# EAGLE schematic microDriver_v2 (EAGLE 8.3.1)

## Sheet 1 of 3
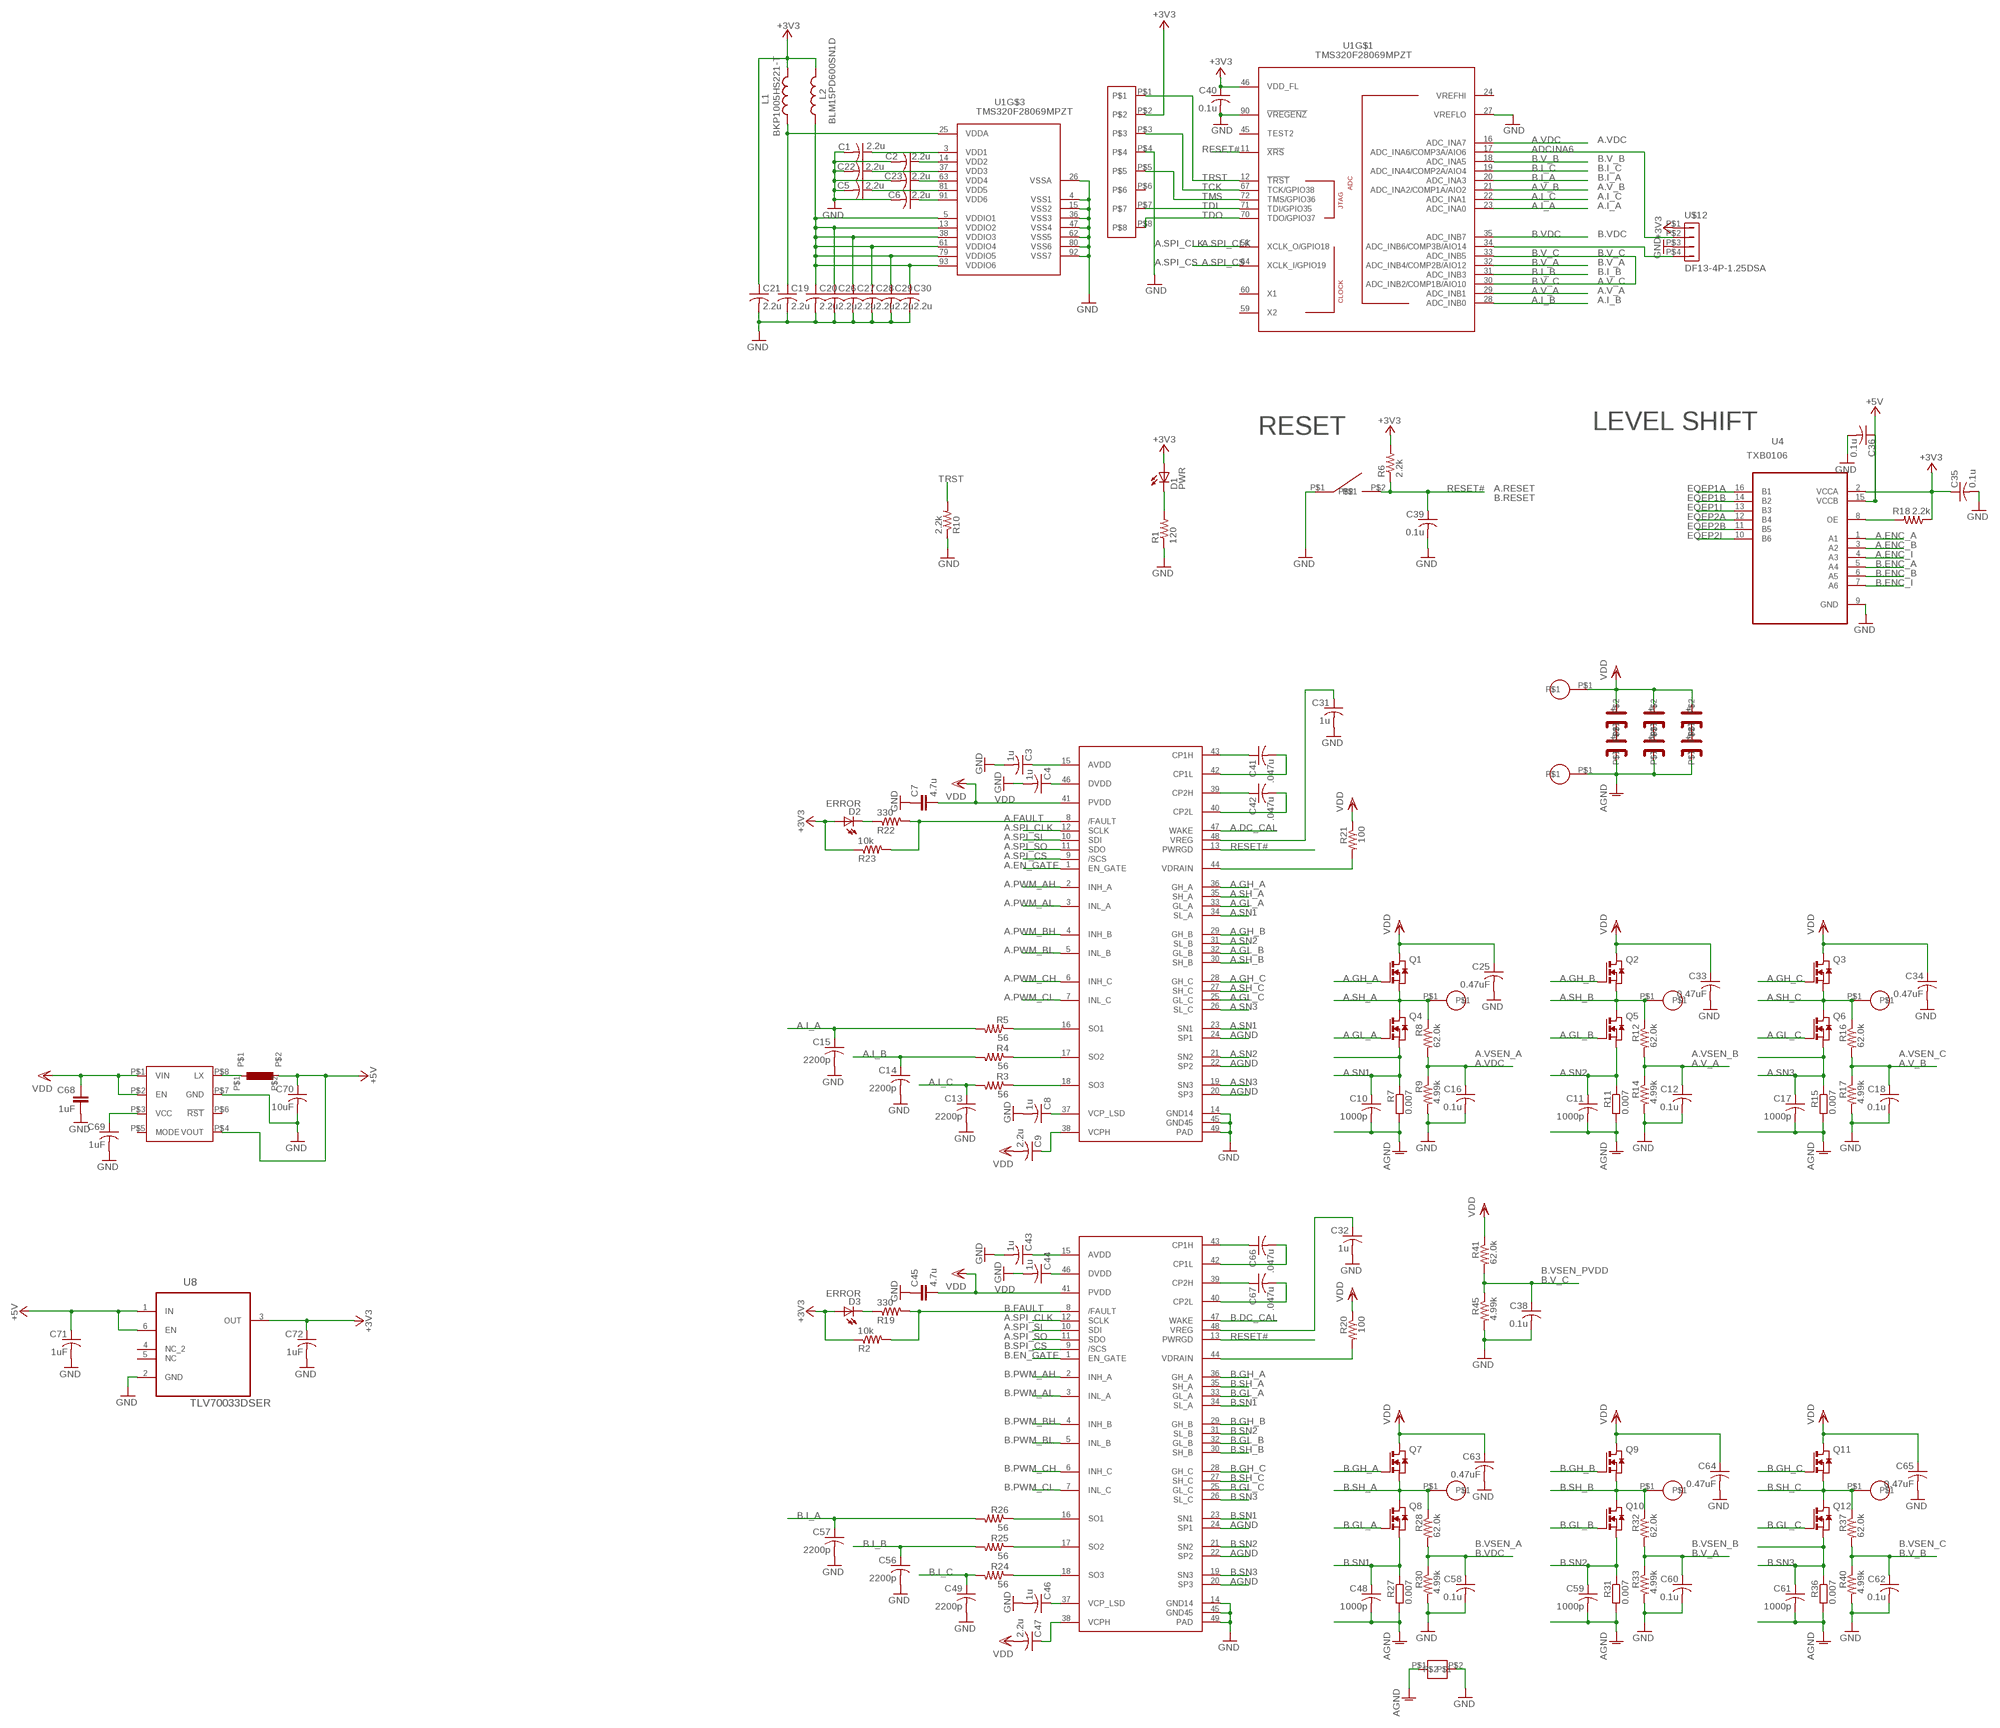
[diagram p0: schematic, sheet 1]

### Parts
B1  B3U  [B3U]
C1  2.2u  C-USC0402  [C0402]
C2  2.2u  C-USC0402  [C0402]
C3  1u  C-USC0402  [C0402]
C4  1u  C-USC0402  [C0402]
C5  2.2u  C-USC0402  [C0402]
C6  2.2u  C-USC0402  [C0402]
C7  4.7u  C-EUC0805K  [C0805K]
C8  1u  C-USC0402  [C0402]
C9  2.2u  C-USC0402  [C0402]
C10  1000p  C-USC0402  [C0402]
C11  1000p  C-USC0402  [C0402]
C12  0.1u  C-USC0402  [C0402]
C13  2200p  C-USC0402  [C0402]
C14  2200p  C-USC0402  [C0402]
C15  2200p  C-USC0402  [C0402]
C16  0.1u  C-USC0402  [C0402]
C17  1000p  C-USC0402  [C0402]
C18  0.1u  C-USC0402  [C0402]
C19  2.2u  C-USC0402  [C0402]
C20  2.2u  C-USC0402  [C0402]
C21  2.2u  C-USC0402  [C0402]
C22  2.2u  C-USC0402  [C0402]
C23  2.2u  C-USC0402  [C0402]
C25  0.47uF  C-USC0402  [C0402]
C26  2.2u  C-USC0402  [C0402]
C27  2.2u  C-USC0402  [C0402]
C28  2.2u  C-USC0402  [C0402]
C29  2.2u  C-USC0402  [C0402]
C30  2.2u  C-USC0402  [C0402]
C31  1u  C-USC0402  [C0402]
C32  1u  C-USC0402  [C0402]
C33  0.47uF  C-USC0402  [C0402]
C34  0.47uF  C-USC0402  [C0402]
C35  0.1u  C-USC0402  [C0402]
C36  0.1u  C-USC0402  [C0402]
C38  0.1u  C-USC0402  [C0402]
C39  0.1u  C-USC0402  [C0402]
C40  0.1u  C-USC0402  [C0402]
C41  .047u  C-USC0402  [C0402]
C42  .047u  C-USC0402  [C0402]
C43  1u  C-USC0402  [C0402]
C44  1u  C-USC0402  [C0402]
C45  4.7u  C-EUC0805K  [C0805K]
C46  1u  C-USC0402  [C0402]
C47  2.2u  C-USC0402  [C0402]
C48  1000p  C-USC0402  [C0402]
C49  2200p  C-USC0402  [C0402]
C56  2200p  C-USC0402  [C0402]
C57  2200p  C-USC0402  [C0402]
C58  0.1u  C-USC0402  [C0402]
C59  1000p  C-USC0402  [C0402]
C60  0.1u  C-USC0402  [C0402]
C61  1000p  C-USC0402  [C0402]
C62  0.1u  C-USC0402  [C0402]
C63  0.47uF  C-USC0402  [C0402]
C64  0.47uF  C-USC0402  [C0402]
C65  0.47uF  C-USC0402  [C0402]
C66  .047u  C-USC0402  [C0402]
C67  .047u  C-USC0402  [C0402]
C68  1uF  C-EUC0603  [C0603]
C69  1uF  C-USC0402  [C0402]
C70  10uF  C-USC0402  [C0402]
C71  1uF  C-USC0402  [C0402]
C72  1uF  C-USC0402  [C0402]
D1  PWR  LEDCHIP-LED0603  [CHIP-LED0603]
D2  ERROR  LEDCHIP-LED0603  [CHIP-LED0603]
D3  ERROR  LEDCHIP-LED0603  [CHIP-LED0603]
I1  NR4018  [4X4]
L1  BKP1005HS221-T  L-US0402  [R0402]
L2  BLM15PD600SN1D  L-US0402  [R0402]
M1  AMP-8  [AMP-MINITEK-8]
Q1  CSD18540  [Q5B]
Q2  CSD18540  [Q5B]
Q3  CSD18540  [Q5B]
Q4  CSD18540  [Q5B]
Q5  CSD18540  [Q5B]
Q6  CSD18540  [Q5B]
Q7  CSD18540  [Q5B]
Q8  CSD18540  [Q5B]
Q9  CSD18540  [Q5B]
Q10  CSD18540  [Q5B]
Q11  CSD18540  [Q5B]
Q12  CSD18540  [Q5B]
R1  120  R-US_R0402  [R0402]
R2  10k  R-US_R0402  [R0402]
R3  56  R-US_R0402  [R0402]
R4  56  R-US_R0402  [R0402]
R5  56  R-US_R0402  [R0402]
R6  2.2k  R-US_R0402  [R0402]
R7  0.007  R-EU_R2512  [R2512]
R8  62.0k  R-US_R0402  [R0402]
R9  4.99k  R-US_R0402  [R0402]
R10  2.2k  R-US_R0402  [R0402]
R11  0.007  R-EU_R2512  [R2512]
R12  62.0k  R-US_R0402  [R0402]
R14  4.99k  R-US_R0402  [R0402]
R15  0.007  R-EU_R2512  [R2512]
R16  62.0k  R-US_R0402  [R0402]
R17  4.99k  R-US_R0402  [R0402]
R18  2.2k  R-US_R0402  [R0402]
R19  330  R-US_R0402  [R0402]
R20  100  R-US_R0402  [R0402]
R21  100  R-US_R0402  [R0402]
R22  330  R-US_R0402  [R0402]
R23  10k  R-US_R0402  [R0402]
R24  56  R-US_R0402  [R0402]
R25  56  R-US_R0402  [R0402]
R26  56  R-US_R0402  [R0402]
R27  0.007  R-EU_R2512  [R2512]
R28  62.0k  R-US_R0402  [R0402]
R30  4.99k  R-US_R0402  [R0402]
R31  0.007  R-EU_R2512  [R2512]
R32  62.0k  R-US_R0402  [R0402]
R33  4.99k  R-US_R0402  [R0402]
R36  0.007  R-EU_R2512  [R2512]
R37  62.0k  R-US_R0402  [R0402]
R40  4.99k  R-US_R0402  [R0402]
R41  62.0k  R-US_R0402  [R0402]
R45  4.99k  R-US_R0402  [R0402]
T1  7343-CAP  [M7343-CAP]
T2  7343-CAP  [M7343-CAP]
T3  7343-CAP  [M7343-CAP]
T4  7343-CAP  [M7343-CAP]
T5  7343-CAP  [M7343-CAP]
T6  7343-CAP  [M7343-CAP]
U1  TMS320F28069MPZT  TMS320F28069PZSR  [PQFP100]
U4  TXB0106  [VQFN-N16]
U5  DRV8305  [HTQFP-48]
U6  DRV8305  [HTQFP-48]
U7  MAX15062  [TDFN-8]
U8  TLV70033DSER  [SON50P150X150X80-6N]
U$2  GND-AGND  [GND-AGND]
U$3  BLDC_PAD  [BLDC_PAD]
U$4  BLDC_PAD  [BLDC_PAD]
U$5  BLDC_PAD  [BLDC_PAD]
U$6  BLDC_PAD  [BLDC_PAD]
U$7  BLDC_PAD  [BLDC_PAD]
U$8  BLDC_PAD  [BLDC_PAD]
U$9  BLDC_PAD  [BLDC_PAD]
U$10  BLDC_PAD  [BLDC_PAD]
U$12  DF13-4P-1.25DSA  [DF13-4P-1.25DSA]

### Nets
+3V3: C21.1 C35.1 C40.1 C72.1 D1.A D2.A D3.A L1.2 L2.2 M1.P$2 R2.1 R6.2 R18.1 R23.1 U1.46(VDD_FL) U4.2(VCCA) U8.3(OUT) U$12.P$1 ; also sheet 2,3
+5V: C36.1 C70.1 C71.1 I1.P$2 U4.15(VCCB) U7.P$4(VOUT) U8.1(IN) U8.6(EN) ; also sheet 3
A.DC_CAL: U6.47(WAKE) ; also sheet 2
A.EN_GATE: U6.1(EN_GATE) ; also sheet 2
A.ENC_A: U4.1(A1) ; also sheet 2
A.ENC_B: U4.3(A2) ; also sheet 2
A.ENC_I: U4.4(A3) ; also sheet 2
A.FAULT: R22.2 R23.2 U6.8(/FAULT) ; also sheet 2
A.GH_A: Q1.4(G) U6.36(GH_A)
A.GH_B: Q2.4(G) U6.29(GH_B)
A.GH_C: Q3.4(G) U6.28(GH_C)
A.GL_A: Q4.4(G) U6.33(GL_A)
A.GL_B: Q5.4(G) U6.32(GL_B)
A.GL_C: Q6.4(G) U6.25(GL_C)
A.I_A: C15.1 R5.2 U1.23(ADC_INA0)
A.I_B: C14.1 R4.2 U1.28(ADC_INB0)
A.I_C: C13.1 R3.2 U1.22(ADC_INA1)
A.PWM_AH: U6.2(INH_A) ; also sheet 2
A.PWM_AL: U6.3(INL_A) ; also sheet 2
A.PWM_BH: U6.4(INH_B) ; also sheet 2
A.PWM_BL: U6.5(INL_B) ; also sheet 2
A.PWM_CH: U6.6(INH_C) ; also sheet 2
A.PWM_CL: U6.7(INL_C) ; also sheet 2
A.SH_A: Q1.1(S) Q1.2(S) Q1.3(S) Q4.5(D) Q4.6(D) Q4.7(D) Q4.8(D) Q4.9(D) R8.1 U6.35(SH_A) U$6.P$1
A.SH_B: Q2.1(S) Q2.2(S) Q2.3(S) Q5.5(D) Q5.6(D) Q5.7(D) Q5.8(D) Q5.9(D) R12.1 U6.30(SH_B) U$7.P$1
A.SH_C: Q3.1(S) Q3.2(S) Q3.3(S) Q6.5(D) Q6.6(D) Q6.7(D) Q6.8(D) Q6.9(D) R16.1 U6.27(SH_C) U$8.P$1
A.SN1: C10.1 Q4.1(S) Q4.2(S) Q4.3(S) R7.1 U6.23(SN1) U6.34(SL_A)
A.SN2: C11.1 Q5.1(S) Q5.2(S) Q5.3(S) R11.1 U6.21(SN2) U6.31(SL_B)
A.SN3: C17.1 Q6.1(S) Q6.2(S) Q6.3(S) R15.1 U6.19(SN3) U6.26(SL_C)
A.SPI_CLK: U1.51(XCLK_O/GPIO18) U5.12(SCLK) U6.12(SCLK) ; also sheet 2
A.SPI_CS: U1.64(XCLK_I/GPIO19) U6.9(/SCS)
A.SPI_SI: U5.10(SDI) U6.10(SDI) ; also sheet 2
A.SPI_SO: U5.11(SDO) U6.11(SDO) ; also sheet 2
A.V_A: C12.1 R12.2 R14.1 U1.29(ADC_INB1)
A.V_B: C18.1 R16.2 R17.1 U1.21(ADC_INA2/COMP1A/AIO2)
A.VDC: C16.1 R8.2 R9.1 U1.16(ADC_INA7)
ADCINA6: U1.17(ADC_INA6/COMP3A/AIO6) U$12.P$2
AGND: C10.2 C11.2 C17.2 C48.2 C59.2 C61.2 R7.2 R11.2 R15.2 R27.2 R31.2 R36.2 T2.- T4.- T6.- U5.20(SP3) U5.22(SP2) U5.24(SP1) U6.20(SP3) U6.22(SP2) U6.24(SP1) U$2.P$1 U$10.P$1
AVDD: C3.1 U6.15(AVDD)
AVDD1: C43.1 U5.15(AVDD)
B.DC_CAL: U5.47(WAKE) ; also sheet 2
B.EN_GATE: U5.1(EN_GATE) ; also sheet 2
B.ENC_A: U4.5(A4) ; also sheet 2
B.ENC_B: U4.6(A5) ; also sheet 2
B.ENC_I: U4.7(A6) ; also sheet 2
B.FAULT: R2.2 R19.2 U5.8(/FAULT) ; also sheet 2
B.GH_A: Q7.4(G) U5.36(GH_A)
B.GH_B: Q9.4(G) U5.29(GH_B)
B.GH_C: Q11.4(G) U5.28(GH_C)
B.GL_A: Q8.4(G) U5.33(GL_A)
B.GL_B: Q10.4(G) U5.32(GL_B)
B.GL_C: Q12.4(G) U5.25(GL_C)
B.I_A: C57.1 R26.2 U1.20(ADC_INA3)
B.I_B: C56.1 R25.2 U1.31(ADC_INB3)
B.I_C: C49.1 R24.2 U1.19(ADC_INA4/COMP2A/AIO4)
B.PWM_AH: U5.2(INH_A) ; also sheet 2
B.PWM_AL: U5.3(INL_A) ; also sheet 2
B.PWM_BH: U5.4(INH_B) ; also sheet 2
B.PWM_BL: U5.5(INL_B) ; also sheet 2
B.PWM_CH: U5.6(INH_C) ; also sheet 2
B.PWM_CL: U5.7(INL_C) ; also sheet 2
B.SH_A: Q7.1(S) Q7.2(S) Q7.3(S) Q8.5(D) Q8.6(D) Q8.7(D) Q8.8(D) Q8.9(D) R28.1 U5.35(SH_A) U$3.P$1
B.SH_B: Q9.1(S) Q9.2(S) Q9.3(S) Q10.5(D) Q10.6(D) Q10.7(D) Q10.8(D) Q10.9(D) R32.1 U5.30(SH_B) U$4.P$1
B.SH_C: Q11.1(S) Q11.2(S) Q11.3(S) Q12.5(D) Q12.6(D) Q12.7(D) Q12.8(D) Q12.9(D) R37.1 U5.27(SH_C) U$5.P$1
B.SN1: C48.1 Q8.1(S) Q8.2(S) Q8.3(S) R27.1 U5.23(SN1) U5.34(SL_A)
B.SN2: C59.1 Q10.1(S) Q10.2(S) Q10.3(S) R31.1 U5.21(SN2) U5.31(SL_B)
B.SN3: C61.1 Q12.1(S) Q12.2(S) Q12.3(S) R36.1 U5.19(SN3) U5.26(SL_C)
B.SPI_CS: U5.9(/SCS) ; also sheet 2
B.V_A: C60.1 R32.2 R33.1 U1.32(ADC_INB4/COMP2B/AIO12)
B.V_B: C62.1 R37.2 R40.1 U1.18(ADC_INA5)
B.V_C: C38.1 R41.2 R45.1 U1.30(ADC_INB2/COMP1B/AIO10) U1.33(ADC_INB5)
B.VDC: C58.1 R28.2 R30.1 U1.35(ADC_INB7)
EQEP1A: U4.16(B1) ; also sheet 3
EQEP1B: U4.14(B2) ; also sheet 3
EQEP1I: U4.13(B3) ; also sheet 3
EQEP2A: U4.12(B4) ; also sheet 3
EQEP2B: U4.11(B5) ; also sheet 3
EQEP2I: U4.10(B6) ; also sheet 3
GND: B1.P$1 C1.2 C2.2 C3.2 C4.2 C5.2 C6.2 C7.1 C8.2 C12.2 C13.2 C14.2 C15.2 C16.2 C18.2 C19.2 C20.2 C21.2 C22.2 C23.2 C25.2 C26.2 C27.2 C28.2 C29.2 C30.2 C31.2 C32.2 C33.2 C34.2 C35.2 C36.2 C38.2 C39.2 C40.2 C43.2 C44.2 C45.1 C46.2 C49.2 C56.2 C57.2 C58.2 C60.2 C62.2 C63.2 C64.2 C65.2 C68.2 C69.2 C70.2 C71.2 C72.2 M1.P$4 R1.1 R9.2 R10.1 R14.2 R17.2 R30.2 R33.2 R40.2 R45.2 U1.4(VSS1) U1.15(VSS2) U1.26(VSSA) U1.27(VREFLO) U1.36(VSS3) U1.47(VSS4) U1.62(VSS5) U1.80(VSS6) U1.90(!VREGENZ) U1.92(VSS7) U4.9(GND) U5.14(GND14) U5.45(GND45) U5.49(PAD) U6.14(GND14) U6.45(GND45) U6.49(PAD) U7.P$7(GND) U8.2(GND) U$2.P$2 U$12.P$3 ; also sheet 2,3
N$1: U1.34(ADC_INB6/COMP3B/AIO14) U$12.P$4
N$2: C4.1 U6.46(DVDD)
N$4: R3.1 U6.18(SO3)
N$5: C8.1 U6.37(VCP_LSD)
N$6: C9.1 U6.38(VCPH)
N$7: C41.1 U6.43(CP1H)
N$8: R4.1 U6.17(SO2)
N$9: R5.1 U6.16(SO1)
N$10: C42.1 U6.39(CP2H)
N$11: C41.2 U6.42(CP1L)
N$12: C42.2 U6.40(CP2L)
N$13: R18.2 U4.8(OE)
N$14: D2.C R22.1
N$15: R21.2 U6.44(VDRAIN)
N$16: C44.1 U5.46(DVDD)
N$17: C46.1 U5.37(VCP_LSD)
N$18: C32.1 U5.48(VREG)
N$19: R24.1 U5.18(SO3)
N$20: C47.1 U5.38(VCPH)
N$21: R25.1 U5.17(SO2)
N$22: R26.1 U5.16(SO1)
N$23: C66.1 U5.43(CP1H)
N$24: C67.1 U5.39(CP2H)
N$25: C66.2 U5.42(CP1L)
N$26: C67.2 U5.40(CP2L)
N$27: D1.C R1.2
N$28: C1.1 U1.3(VDD1)
N$29: C2.1 U1.14(VDD2)
N$30: C22.1 U1.37(VDD3)
N$31: C23.1 U1.63(VDD4)
N$32: T1.- T2.+
N$33: T3.- T4.+
N$34: R20.2 U5.44(VDRAIN)
N$35: C5.1 U1.81(VDD5)
N$36: C6.1 U1.91(VDD6)
N$39: D3.C R19.1
N$43: T5.- T6.+
N$47: C31.1 U6.48(VREG)
N$49: I1.P$1 U7.P$8(LX)
N$53: C69.1 U7.P$3(VCC)
RESET#: B1.P$2 C39.1 R6.1 U1.11(!XRS) U5.13(PWRGD) U6.13(PWRGD)
TCK: M1.P$3 U1.67(TCK/GPIO38)
TDI: M1.P$7 U1.71(TDI/GPIO35)
TDO: M1.P$8 U1.70(TDO/GPIO37)
TMS: M1.P$5 U1.72(TMS/GPIO36)
TRST: M1.P$1 R10.2 U1.12(!TRST)
VDD: C7.2 C9.2 C25.1 C33.1 C34.1 C45.2 C47.2 C63.1 C64.1 C65.1 C68.1 Q1.5(D) Q1.6(D) Q1.7(D) Q1.8(D) Q1.9(D) Q2.5(D) Q2.6(D) Q2.7(D) Q2.8(D) Q2.9(D) Q3.5(D) Q3.6(D) Q3.7(D) Q3.8(D) Q3.9(D) Q7.5(D) Q7.6(D) Q7.7(D) Q7.8(D) Q7.9(D) Q9.5(D) Q9.6(D) Q9.7(D) Q9.8(D) Q9.9(D) Q11.5(D) Q11.6(D) Q11.7(D) Q11.8(D) Q11.9(D) R20.1 R21.1 R41.1 T1.+ T3.+ T5.+ U5.41(PVDD) U6.41(PVDD) U7.P$1(VIN) U7.P$2(EN) U$9.P$1
VDDA: C19.1 L1.1 U1.25(VDDA)
VDDIO: C20.1 C26.1 C27.1 C28.1 C29.1 C30.1 L2.1 U1.5(VDDIO1) U1.13(VDDIO2) U1.38(VDDIO3) U1.61(VDDIO4) U1.79(VDDIO5) U1.93(VDDIO6)
Unconnected: M1.P$6 U1.24(VREFHI) U1.45(TEST2) U1.59(X2) U1.60(X1) U7.P$5(MODE) U7.P$6(!RST!) U8.4(NC_2) U8.5(NC)

### Notes on the sheet
- A.VDC
- B.V_B
- B.I_C
- B.I_A
- A.V_B
- A.I_C
- A.I_A
- B.VDC
- A.SPI_CLK
- B.V_C
- A.SPI_CS | B.V_A
- B.I_B
- A.V_C
- A.V_A
- A.I_B
- RESET | LEVEL SHIFT
- A.RESET
- B.RESET
- A.VSEN_A | A.VSEN_B | A.VSEN_C
- B.VSEN_PVDD
- B.VSEN_A | B.VSEN_B | B.VSEN_C

## Sheet 2 of 3
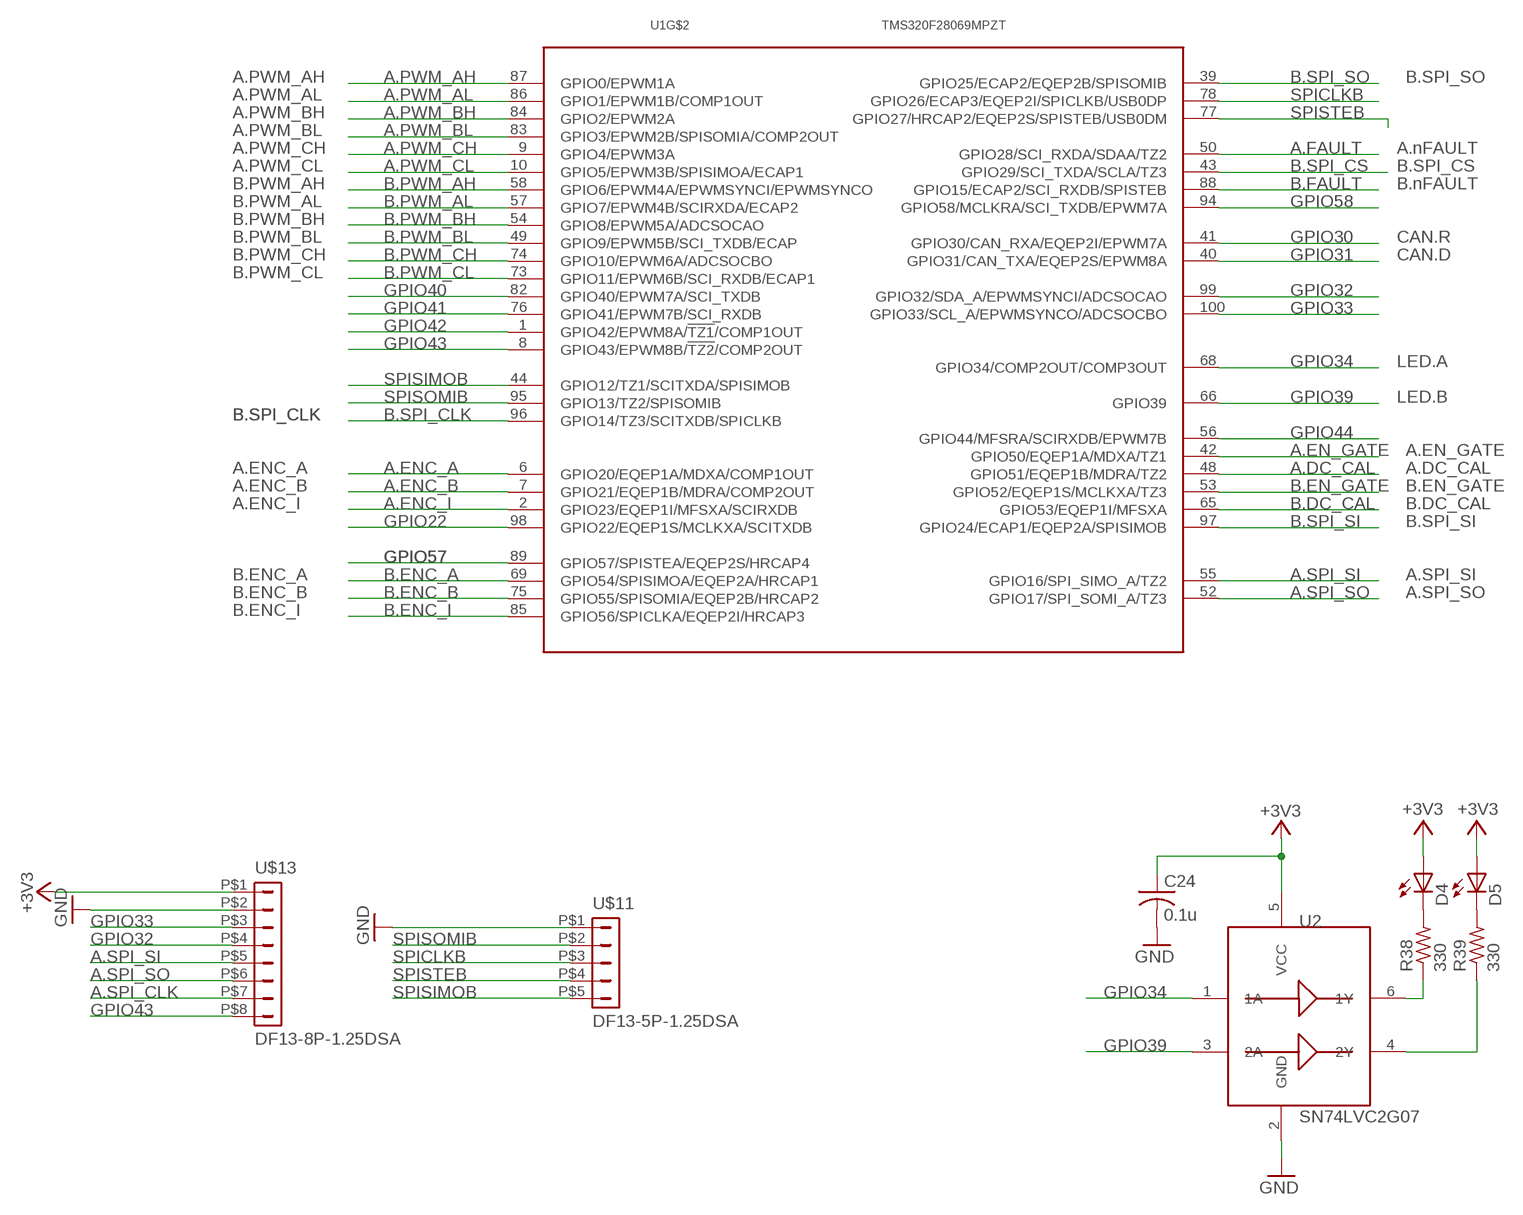
[diagram p1: schematic, sheet 2]

### Parts
C24  0.1u  C-USC0402  [C0402]
D4  LEDCHIP-LED0603  [CHIP-LED0603]
D5  LEDCHIP-LED0603  [CHIP-LED0603]
R38  330  R-US_R0402  [R0402]
R39  330  R-US_R0402  [R0402]
U2  SN74LVC2G07  [SOT23-6-DBV]
U$11  DF13-5P-1.25DSA  [DF13-5P-1.25DSA]
U$13  DF13-8P-1.25DSA  [DF13-8P-1.25DSA]

### Nets
+3V3: C24.1 D4.A D5.A U2.5(VCC) U$13.P$1 ; also sheet 1,3
A.DC_CAL: U1.48(GPIO51/EQEP1B/MDRA/TZ2) ; also sheet 1
A.EN_GATE: U1.42(GPIO50/EQEP1A/MDXA/TZ1) ; also sheet 1
A.ENC_A: U1.6(GPIO20/EQEP1A/MDXA/COMP1OUT) ; also sheet 1
A.ENC_B: U1.7(GPIO21/EQEP1B/MDRA/COMP2OUT) ; also sheet 1
A.ENC_I: U1.2(GPIO23/EQEP1I/MFSXA/SCIRXDB) ; also sheet 1
A.FAULT: U1.50(GPIO28/SCI_RXDA/SDAA/TZ2) ; also sheet 1
A.PWM_AH: U1.87(GPIO0/EPWM1A) ; also sheet 1
A.PWM_AL: U1.86(GPIO1/EPWM1B/COMP1OUT) ; also sheet 1
A.PWM_BH: U1.84(GPIO2/EPWM2A) ; also sheet 1
A.PWM_BL: U1.83(GPIO3/EPWM2B/SPISOMIA/COMP2OUT) ; also sheet 1
A.PWM_CH: U1.9(GPIO4/EPWM3A) ; also sheet 1
A.PWM_CL: U1.10(GPIO5/EPWM3B/SPISIMOA/ECAP1) ; also sheet 1
A.SPI_CLK: U$13.P$7 ; also sheet 1
A.SPI_SI: U1.55(GPIO16/SPI_SIMO_A/TZ2) U$13.P$5 ; also sheet 1
A.SPI_SO: U1.52(GPIO17/SPI_SOMI_A/TZ3) U$13.P$6 ; also sheet 1
B.DC_CAL: U1.65(GPIO53/EQEP1I/MFSXA) ; also sheet 1
B.EN_GATE: U1.53(GPIO52/EQEP1S/MCLKXA/TZ3) ; also sheet 1
B.ENC_A: U1.69(GPIO54/SPISIMOA/EQEP2A/HRCAP1) ; also sheet 1
B.ENC_B: U1.75(GPIO55/SPISOMIA/EQEP2B/HRCAP2) ; also sheet 1
B.ENC_I: U1.85(GPIO56/SPICLKA/EQEP2I/HRCAP3) ; also sheet 1
B.FAULT: U1.88(GPIO15/ECAP2/SCI_RXDB/SPISTEB) ; also sheet 1
B.PWM_AH: U1.58(GPIO6/EPWM4A/EPWMSYNCI/EPWMSYNCO) ; also sheet 1
B.PWM_AL: U1.57(GPIO7/EPWM4B/SCIRXDA/ECAP2) ; also sheet 1
B.PWM_BH: U1.54(GPIO8/EPWM5A/ADCSOCAO) ; also sheet 1
B.PWM_BL: U1.49(GPIO9/EPWM5B/SCI_TXDB/ECAP) ; also sheet 1
B.PWM_CH: U1.74(GPIO10/EPWM6A/ADCSOCBO) ; also sheet 1
B.PWM_CL: U1.73(GPIO11/EPWM6B/SCI_RXDB/ECAP1) ; also sheet 1
B.SPI_CLK: U1.96(GPIO14/TZ3/SCITXDB/SPICLKB)
B.SPI_CS: U1.43(GPIO29/SCI_TXDA/SCLA/TZ3) ; also sheet 1
B.SPI_SI: U1.97(GPIO24/ECAP1/EQEP2A/SPISIMOB)
B.SPI_SO: U1.39(GPIO25/ECAP2/EQEP2B/SPISOMIB)
GND: C24.2 U2.2(GND) U$11.P$1 U$13.P$2 ; also sheet 1,3
GPIO22: U1.98(GPIO22/EQEP1S/MCLKXA/SCITXDB)
GPIO30: U1.41(GPIO30/CAN_RXA/EQEP2I/EPWM7A) ; also sheet 3
GPIO31: U1.40(GPIO31/CAN_TXA/EQEP2S/EPWM8A) ; also sheet 3
GPIO32: U1.99(GPIO32/SDA_A/EPWMSYNCI/ADCSOCAO) U$13.P$4
GPIO33: U1.100(GPIO33/SCL_A/EPWMSYNCO/ADCSOCBO) U$13.P$3
GPIO34: U1.68(GPIO34/COMP2OUT/COMP3OUT) U2.1(1A)
GPIO39: U1.66(GPIO39) U2.3(2A)
GPIO40: U1.82(GPIO40/EPWM7A/SCI_TXDB)
GPIO41: U1.76(GPIO41/EPWM7B/SCI_RXDB)
GPIO42: U1.1(GPIO42/EPWM8A/!TZ1!/COMP1OUT)
GPIO43: U1.8(GPIO43/EPWM8B/!TZ2!/COMP2OUT) U$13.P$8
GPIO44: U1.56(GPIO44/MFSRA/SCIRXDB/EPWM7B)
GPIO57: U1.89(GPIO57/SPISTEA/EQEP2S/HRCAP4)
GPIO58: U1.94(GPIO58/MCLKRA/SCI_TXDB/EPWM7A)
N$38: D4.C R38.2
N$40: D5.C R39.2
N$42: R38.1 U2.6(1Y)
N$59: R39.1 U2.4(2Y)
SPICLKB: U1.78(GPIO26/ECAP3/EQEP2I/SPICLKB/USB0DP) U$11.P$3
SPISIMOB: U1.44(GPIO12/TZ1/SCITXDA/SPISIMOB) U$11.P$5
SPISOMIB: U1.95(GPIO13/TZ2/SPISOMIB) U$11.P$2
SPISTEB: U1.77(GPIO27/HRCAP2/EQEP2S/SPISTEB/USB0DM) U$11.P$4

### Notes on the sheet
- A.PWM_AH | B.SPI_SO
- A.PWM_AL
- A.PWM_BH
- A.PWM_BL
- A.PWM_CH | A.nFAULT
- A.PWM_CL | B.SPI_CS
- B.PWM_AH | B.nFAULT
- B.PWM_AL
- B.PWM_BH
- B.PWM_BL | CAN.R
- B.PWM_CH | CAN.D
- B.PWM_CL
- LED.A
- LED.B
- B.SPI_CLK | B.SPI_CLK
- A.EN_GATE
- A.ENC_A | A.DC_CAL
- A.ENC_B | B.EN_GATE
- A.ENC_I | B.DC_CAL
- B.SPI_SI
- B.ENC_A | A.SPI_SI
- B.ENC_B | A.SPI_SO
- B.ENC_I

## Sheet 3 of 3
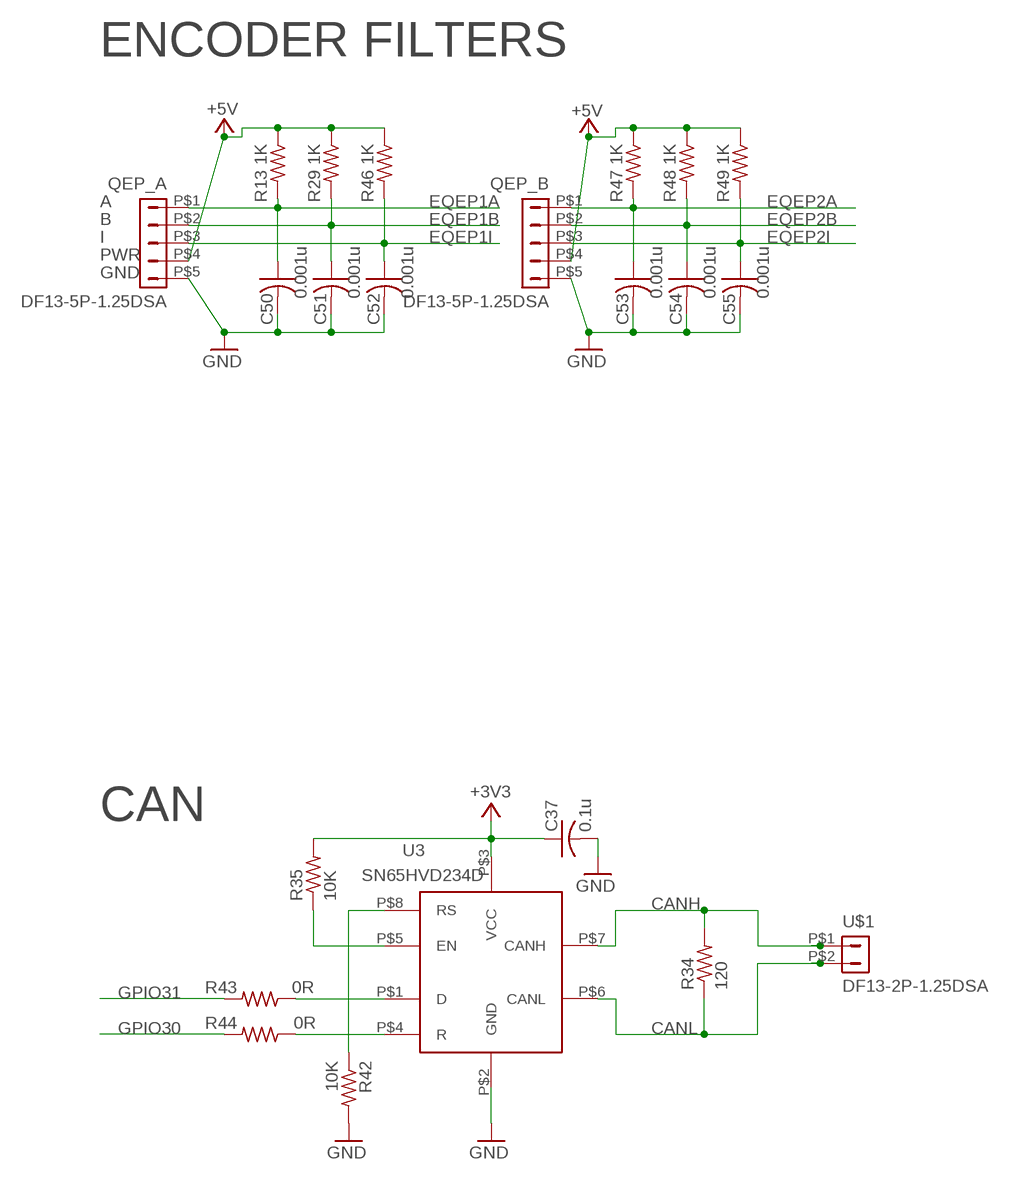
[diagram p2: schematic, sheet 3]

### Parts
C37  0.1u  C-USC0402  [C0402]
C50  0.001u  C-USC0402  [C0402]
C51  0.001u  C-USC0402  [C0402]
C52  0.001u  C-USC0402  [C0402]
C53  0.001u  C-USC0402  [C0402]
C54  0.001u  C-USC0402  [C0402]
C55  0.001u  C-USC0402  [C0402]
QEP_A  DF13-5P-1.25DSA  [DF13-5P-1.25DSA]
QEP_B  DF13-5P-1.25DSA  [DF13-5P-1.25DSA]
R13  1K  R-US_R0402  [R0402]
R29  1K  R-US_R0402  [R0402]
R34  120  R-US_R0402  [R0402]
R35  10K  R-US_R0402  [R0402]
R42  10K  R-US_R0402  [R0402]
R43  0R  R-US_R0402  [R0402]
R44  0R  R-US_R0402  [R0402]
R46  1K  R-US_R0402  [R0402]
R47  1K  R-US_R0402  [R0402]
R48  1K  R-US_R0402  [R0402]
R49  1K  R-US_R0402  [R0402]
U3  SN65HVD234D  [SOIC8-PDSO]
U$1  DF13-2P-1.25DSA  [DF13-2P-1.25DSA]

### Nets
+3V3: C37.1 R35.2 U3.P$3(VCC) ; also sheet 1,2
+5V: QEP_A.P$4 QEP_B.P$4 R13.1 R29.1 R46.1 R47.1 R48.1 R49.1 ; also sheet 1
CANH: R34.2 U3.P$7(CANH) U$1.P$1
CANL: R34.1 U3.P$6(CANL) U$1.P$2
EQEP1A: C50.1 QEP_A.P$1 R13.2 ; also sheet 1
EQEP1B: C51.1 QEP_A.P$2 R29.2 ; also sheet 1
EQEP1I: C52.1 QEP_A.P$3 R46.2 ; also sheet 1
EQEP2A: C53.1 QEP_B.P$1 R47.2 ; also sheet 1
EQEP2B: C54.1 QEP_B.P$2 R48.2 ; also sheet 1
EQEP2I: C55.1 QEP_B.P$3 R49.2 ; also sheet 1
GND: C37.2 C50.2 C51.2 C52.2 C53.2 C54.2 C55.2 QEP_A.P$5 QEP_B.P$5 R42.2 U3.P$2(GND) ; also sheet 1,2
GPIO30: R44.2 ; also sheet 2
GPIO31: R43.2 ; also sheet 2
N$44: R35.1 U3.P$5(EN)
N$45: R42.1 U3.P$8(RS)
N$46: R43.1 U3.P$1(D)
N$48: R44.1 U3.P$4(R)

### Notes on the sheet
- ENCODER FILTERS
- A
- B
- I
- PWR
- GND
- CAN

## Library data of the parts
B1 = zz-upenn:B3U
C1-C6 C8-C44 C46-C67 C69-C72 = rcl:C-US: CAPACITOR, American symbol
C7 C45 = resistor:C-EU: CAPACITOR, European symbol
C68 = rcl:C-EU: CAPACITOR, European symbol
D1-D5 = led:LED: LED OSRAM: - CHIPLED LG R971, LG N971, LY N971, LG Q971, LY Q971, LO R971, LY R971 LH N974, LH R974 LS Q976, LO Q976, LY Q976 LO Q996 - Hyper CHIPLED LW Q18S LB Q993, LB Q99A, LB R99A - SideLED LS A670, LO A670, LY A670, LG A670, LP A670 LB A673, LV A673, LT A673, LW A673 LH A674 LY A675 LS A676, LA A676, LO A676, LY A676, LW A676 LS A679, LY A679, LG A679 - Hyper Micro SIDELED® LS Y876, LA Y876, LO Y876, LY Y876 LT Y87S - SmartLED LW L88C, LW L88S LB L89C, LB L89S, LG L890 LS L89K, LO L89K, LY L89K LS L896, LA L896, LO L896, LY L896 - TOPLED LS T670, LO T670, LY T670, LG T670, LP T670 LSG T670, LSP T670, LSY T670, LOP T670, LYG T670 LG T671, LOG T671, LSG T671 LB T673, LV T673, LT T673, LW T673 LH T674 LS T676, LA T676, LO T676, LY T676, LB T676, LH T676, LSB T676, LW T676 LB T67C, LV T67C, LT T67C, LS T67K, LO T67K, LY T67K, LW E67C LS E67B, LA E67B, LO E67B, LY E67B, LB E67C, LV E67C, LT E67C LW T67C LS T679, LY T679, LG T679 LS T770, LO T770, LY T770, LG T770, LP T770 LB T773, LV T773, LT T773, LW T773 LH T774 LS E675, LA E675, LY E675, LS T675 LS T776, LA T776, LO T776, LY T776, LB T776 LHGB T686 LT T68C, LB T68C - Hyper Mini TOPLED® LB M676 - Mini TOPLED Santana® LG M470 LS M47K, LO M47K, LY M47K Source: http://www.osram.convergy.de LUXEON: - LUMILED® LXK2-PW12-R00, LXK2-PW12-S00, LXK2-PW14-U00, LXK2-PW14-V00 LXK2-PM12-R00, LXK2-PM12-S00, LXK2-PM14-U00 LXK2-PE12-Q00, LXK2-PE12-R00, LXK2-PE12-S00, LXK2-PE14-T00, LXK2-PE14-U00 LXK2-PB12-K00, LXK2-PB12-L00, LXK2-PB12-M00, LXK2-PB14-N00, LXK2-PB14-P00, LXK2-PB14-Q00 LXK2-PR12-L00, LXK2-PR12-M00, LXK2-PR14-Q00, LXK2-PR14-R00 LXK2-PD12-Q00, LXK2-PD12-R00, LXK2-PD12-S00 LXK2-PH12-R00, LXK2-PH12-S00 LXK2-PL12-P00, LXK2-PL12-Q00, LXK2-PL12-R00 Source: www.luxeon.com KINGBRIGHT: KA-3528ASYC Source: www.kingbright.com
I1 = zz-jpf:NR4018
L1 L2 = rcl:L-US: INDUCTOR, American symbol
M1 = zz-MPI:AMP-8
Q1-Q12 = zz-MPI:CSD18540
QEP_A QEP_B U$11 = con-hirose-df13:DF13-5P-1.25: DF13-5P 1.25mm Pitch Miniature Crimping Connector.
R1-R6 R8-R10 R12-R14 R16-R26 R28-R30 R32-R35 R37-R49 = rcl:R-US_: RESISTOR, American symbol
R7 R11 R15 R27 R31 R36 = resistor:R-EU_: RESISTOR, European symbol
T1-T6 = zz-MPI:7343-CAP
U1 = LAUNCHXL-F28027:TMS320F28069PZS
U2 = texas:SN74LVC2G07
U3 = LAUNCHXL-F28027:SN65HVD234D
U4 = zz-MPI:TXB0106
U5 U6 = zz-MPI:DRV8305
U7 = zz-jpf:MAX15062
U8 = Texas Instruments_By_element14_Batch_1:TLV70033DSER: 200-mA, Low-IQ, Low-Dropout Regulator for Portable Devices; MPN: TLV70033DSER; OC_FARNELL: -; OC_NEWARK: 50R8014; PACKAGE: SON-6; SUPPLIER: Texas Instruments
U$1 = con-hirose-df13:DF13-2P-1.25: DF13-2P 1.25mm Pitch Miniature Crimping Connector.
U$2 = zz-MPI:GND-AGND
U$3-U$10 = zz-MPI:BLDC_PAD
U$12 = con-hirose-df13:DF13-4P-1.25: DF13-4P 1.25mm Pitch Miniature Crimping Connector.
U$13 = con-hirose-df13:DF13-8P-1.25: DF13-8P 1.25mm Pitch Miniature Crimping Connector.

## Net classes
0 default: width 0.152 mm, drill 0.203 mm, clearance 0.152 mm